# EAGLE design satshakit-grbl (EAGLE 8.4.3)

## Sheet 1 of 2
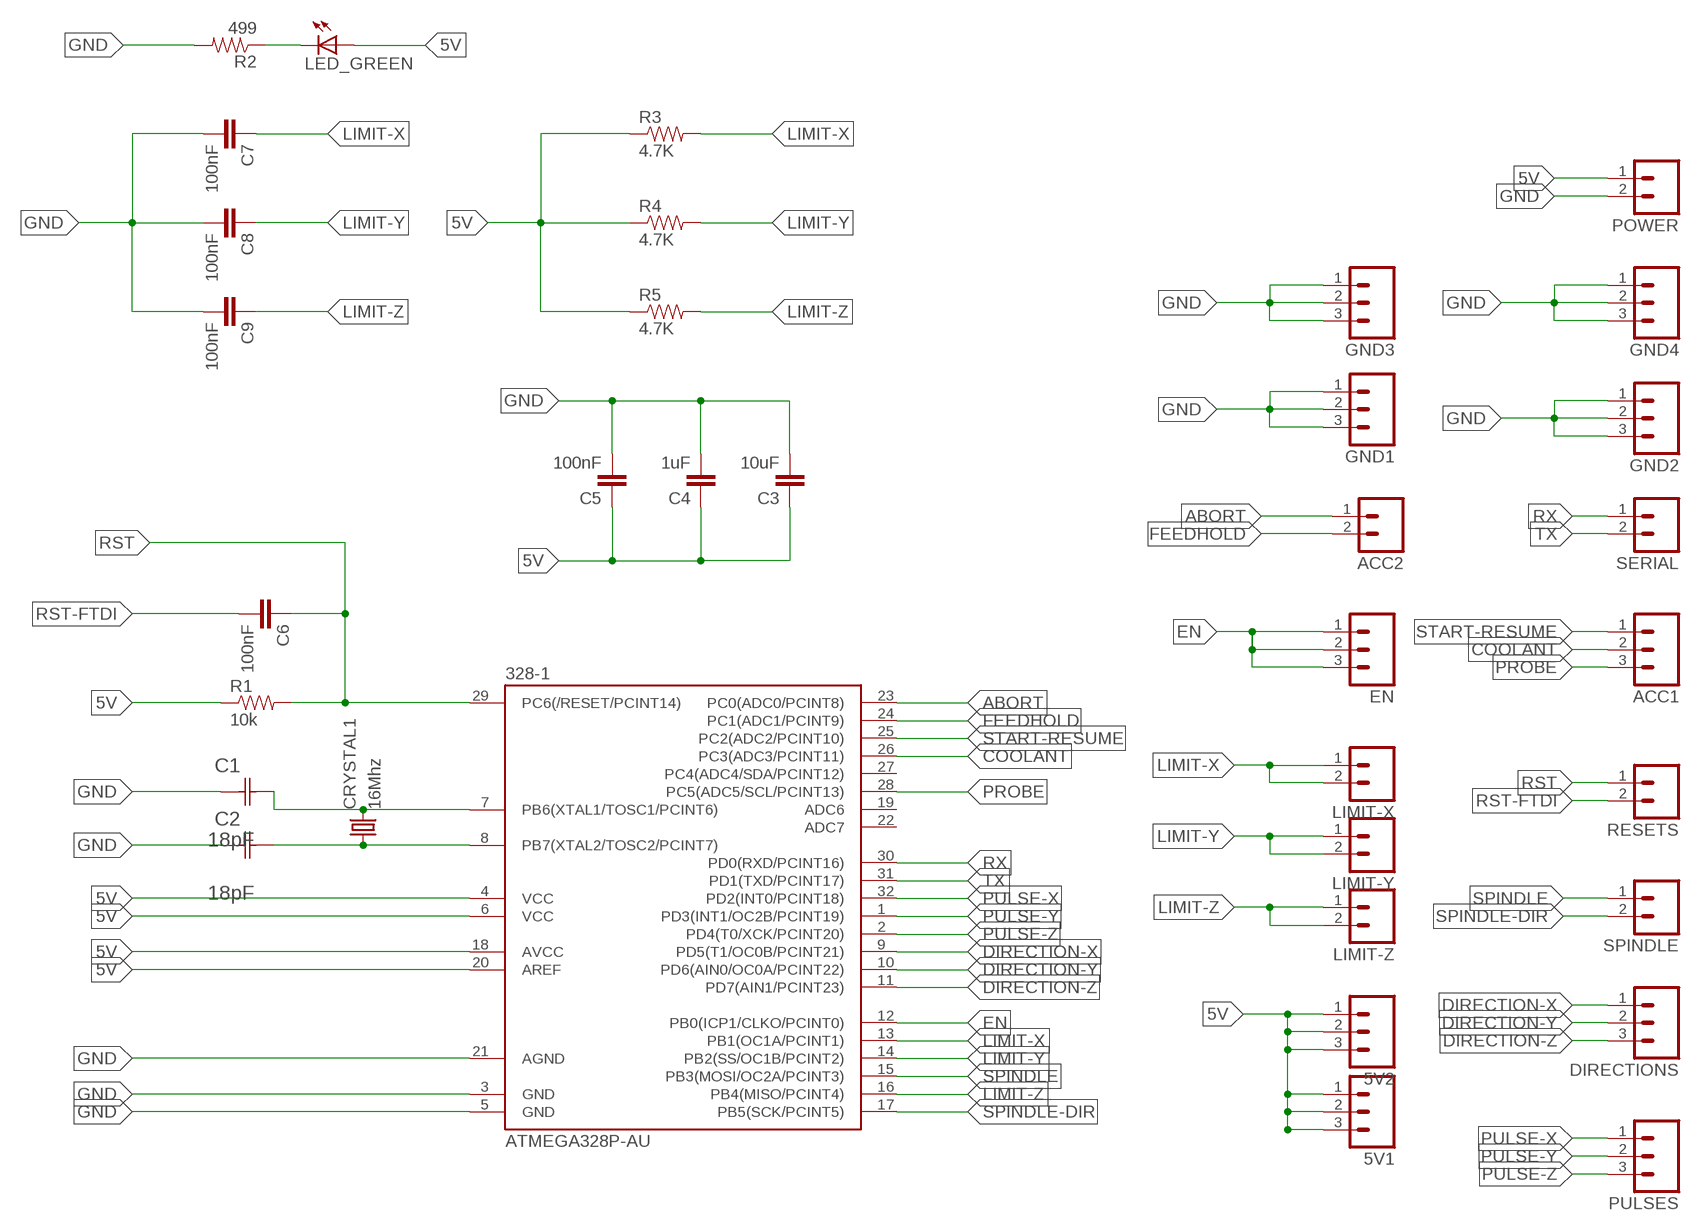
[diagram p0: schematic, sheet 1]

### Parts
5V1  M03  [03P]
5V2  M03  [03P]
328-1  ATMEGA328P-AU  ATMEGA48/88/168-AU  [TQFP32-08]
ACC1  M03  [03P]
ACC2  M02  [02P]
C1  18pF  0612ZC225MAT2A  [CAPC3216X178N]
C2  18pF  0612ZC225MAT2A  [CAPC3216X178N]
C3  10uF  CAP1206  [1206]
C4  1uF  CAP1206  [1206]
C5  100nF  CAP1206  [1206]
C6  100nF  CAP1206  [1206]
C7  100nF  CAP1206  [1206]
C8  100nF  CAP1206  [1206]
C9  100nF  CAP1206  [1206]
CRYSTAL1  16Mhz  CSM-7X-DU  [CSM-7X-DU]
DIRECTIONS  M03  [03P]
EN  M03  [03P]
GND1  M03  [03P]
GND2  M03  [03P]
GND3  M03  [03P]
GND4  M03  [03P]
LED_GREEN  LED1206  [1206]
LIMIT-X  M02  [02P]
LIMIT-Y  M02  [02P]
LIMIT-Z  M02  [02P]
POWER  M02  [02P]
PULSES  M03  [03P]
R1  10k  RESISTOR1206  [1206]
R2  499  RESISTOR1206  [1206]
R3  4.7K  RESISTOR1206  [1206]
R4  4.7K  RESISTOR1206  [1206]
R5  4.7K  RESISTOR1206  [1206]
RESETS  M02  [02P]
SERIAL  M02  [02P]
SPINDLE  M02  [02P]

### Nets
5V: 5V1.1 5V1.2 5V1.3 5V2.1 5V2.2 5V2.3 328-1.4(VCC) 328-1.6(VCC) 328-1.18(AVCC) 328-1.20(AREF) C3.1 C4.1 C5.1 LED_GREEN.1(A) POWER.1 R1.1 R3.1 R4.1 R5.1
ABORT: 328-1.23(PC0(ADC0/PCINT8)) ACC2.1
COOLANT: 328-1.26(PC3(ADC3/PCINT11)) ACC1.2
DIRECTION-X: 328-1.9(PD5(T1/OC0B/PCINT21)) DIRECTIONS.1
DIRECTION-Y: 328-1.10(PD6(AIN0/OC0A/PCINT22)) DIRECTIONS.2
DIRECTION-Z: 328-1.11(PD7(AIN1/PCINT23)) DIRECTIONS.3
EN: 328-1.12(PB0(ICP1/CLKO/PCINT0)) EN.1 EN.2 EN.3
FEEDHOLD: 328-1.24(PC1(ADC1/PCINT9)) ACC2.2
GND: 328-1.3(GND) 328-1.5(GND) 328-1.21(AGND) C1.1(C1) C2.1(C1) C3.2 C4.2 C5.2 C7.2 C8.2 C9.2 GND1.1 GND1.2 GND1.3 GND2.1 GND2.2 GND2.3 GND3.1 GND3.2 GND3.3 GND4.1 GND4.2 GND4.3 POWER.2 R2.2
LIMIT-X: 328-1.13(PB1(OC1A/PCINT1)) C7.1 LIMIT-X.1 LIMIT-X.2 R3.2
LIMIT-Y: 328-1.14(PB2(SS/OC1B/PCINT2)) C8.1 LIMIT-Y.1 LIMIT-Y.2 R4.2
LIMIT-Z: 328-1.16(PB4(MISO/PCINT4)) C9.1 LIMIT-Z.1 LIMIT-Z.2 R5.2
N$2: 328-1.7(PB6(XTAL1/TOSC1/PCINT6)) C1.2(C2) CRYSTAL1.2
N$9: 328-1.8(PB7(XTAL2/TOSC2/PCINT7)) C2.2(C2) CRYSTAL1.1
N$26: LED_GREEN.2(C) R2.1
PROBE: 328-1.28(PC5(ADC5/SCL/PCINT13)) ACC1.3
PULSE-X: 328-1.32(PD2(INT0/PCINT18)) PULSES.1
PULSE-Y: 328-1.1(PD3(INT1/OC2B/PCINT19)) PULSES.2
PULSE-Z: 328-1.2(PD4(T0/XCK/PCINT20)) PULSES.3
RST: 328-1.29(PC6(/RESET/PCINT14)) C6.1 R1.2 RESETS.1
RST-FTDI: C6.2 RESETS.2
RX: 328-1.30(PD0(RXD/PCINT16)) SERIAL.1
SPINDLE: 328-1.15(PB3(MOSI/OC2A/PCINT3)) SPINDLE.1
SPINDLE-DIR: 328-1.17(PB5(SCK/PCINT5)) SPINDLE.2
START-RESUME: 328-1.25(PC2(ADC2/PCINT10)) ACC1.1
TX: 328-1.31(PD1(TXD/PCINT17)) SERIAL.2
Unconnected: 328-1.19(ADC6) 328-1.22(ADC7) 328-1.27(PC4(ADC4/SDA/PCINT12))

## Sheet 2 of 2

## Library data of the parts
5V1 5V2 ACC1 DIRECTIONS EN GND1-GND4 PULSES = con-amp-quick:M03: AMP QUICK CONNECTOR; OC_FARNELL: unknown; OC_NEWARK: unknown
328-1 = atmega8:ATMEGA48/88/168
ACC2 LIMIT-X LIMIT-Y LIMIT-Z POWER RESETS SERIAL SPINDLE = con-amp-quick:M02: AMP QUICK CONNECTOR; OC_FARNELL: unknown; OC_NEWARK: unknown
C1 C2 = AVX_By_element14_Batch_1:0612ZC225MAT2A: Capacitor 1206; MPN: 0612ZC225MAT2A; OC_FARNELL: -; OC_NEWARK: 12N3209; SUPPLIER: AVX; TOLERANCE: ±20%; VALUE: 2.2µF; VOLTAGERATING: 10V
C3-C9 = 01_SparkFun:CAP: Capacitor Standard 0603 ceramic capacitor, and 0.1" leaded capacitor.
CRYSTAL1 = 01_FAB_Hello:CSM-7X-DU: SMD CRYSTAL Source: www.ecsxtal.com .. Crystal 3.6864MHz CSM_7X_DU.PDF; OC_FARNELL: unknown; OC_NEWARK: unknown
LED_GREEN = 01_FAB_Hello:LED
R1-R5 = 01_SparkFun:RESISTOR: Resistor Basic schematic elements and footprints for 0603, 1206, and PTH 1/10th watt (small) resistors.

## Board
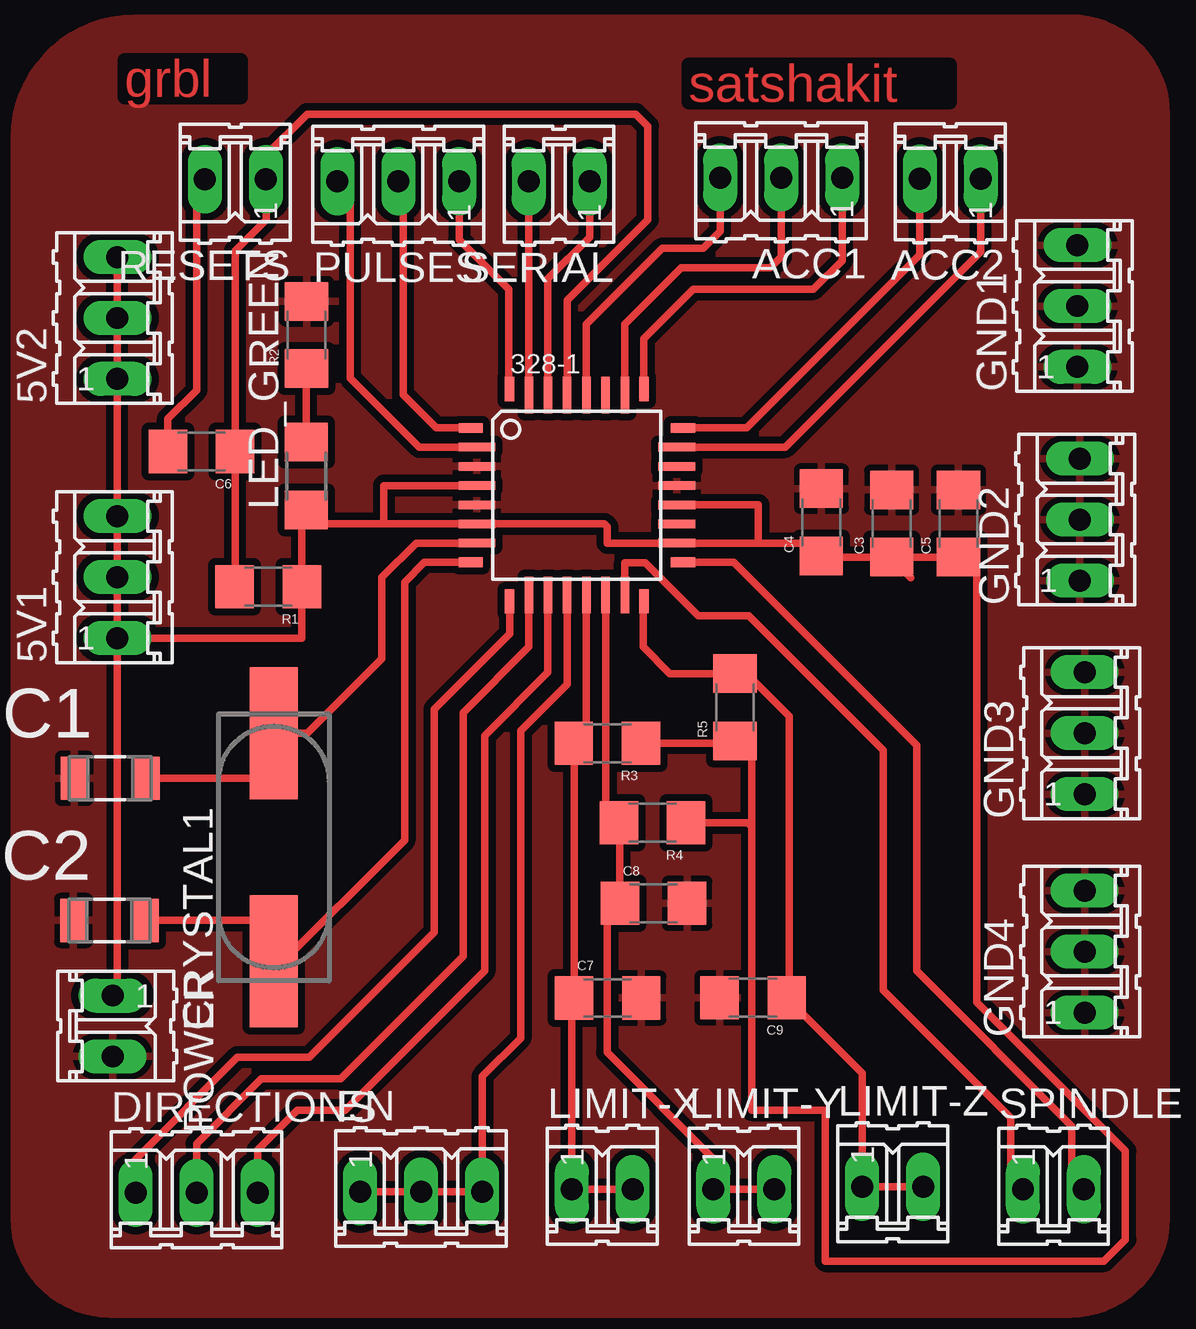
[diagram p1: board, top side]

No outline drawn. Coordinates in mm, seen from the top.
Copper layers (1*16): Top 0.035mm / dielectric 1.5mm / Bottom 0.035mm
Design rules "default": minimum track width 10mil, minimum drill 24mil, track to track 8mil, track to pad 8mil, pad to pad 8mil, via to via 8mil, smd to smd 8mil, copper to edge 40mil, drill to drill 8mil, minimum pad ring 10mil, minimum via ring 8mil, stop-mask expansion 4mil, vias tented up to drill 0mil, thermal gap 10mil

### Footprints (pad centres in the part's own frame; a part is rotated, then mirrored left to right if it is on the bottom)
03P = drill 0.914 long: 1 -2.54,0; 2 0,0; 3 2.54,0
TQFP32-08 = smd 1.016 x 0.406: 1 -4.42,2.8; 8 -4.42,-2.8; 17 4.42,-2.8; 24 4.42,2.8 | smd 1.524 x 0.356: 2 -4.166,2; 3 -4.166,1.2; 4 -4.166,0.4; 5 -4.166,-0.4; 6 -4.166,-1.2; 7 -4.166,-2; 18 4.166,-2; 19 4.166,-1.2; 20 4.166,-0.4; 21 4.166,0.4; 22 4.166,1.2; 23 4.166,2 | smd 0.406 x 1.016: 9 -2.8,-4.42; 16 2.8,-4.42; 25 2.8,4.42; 32 -2.8,4.42 | smd 0.356 x 1.524: 10 -2,-4.166; 11 -1.2,-4.166; 12 -0.4,-4.166; 13 0.4,-4.166; 14 1.2,-4.166; 15 2,-4.166; 26 2,4.166; 27 1.2,4.166; 28 0.4,4.166; 29 -0.4,4.166; 30 -1.2,4.166; 31 -2,4.166
02P = drill 0.914 long: 1 -1.27,0; 2 1.27,0
CAPC3216X178N = smd 1.118 x 1.803: 1 -1.499,0; 2 1.499,0
1206 = smd 1.6 x 1.8: 1 -1.4,0; 2 1.4,0
CSM-7X-DU = smd 5.5 x 2: 1 -4.75,0; 2 4.75,0
1206' = smd 1.6 x 1.803: 1 -1.422,0; 2 1.422,0

### Placement (x,y rotation side)
5V1  56.3,51.7 90 top
5V2  56.3,62.5 90 top
328-1  75.44,55.12 0 top
ACC1  83.95,68.35 180 top
ACC2  91,68.3 180 top
C1  56,43.32 0 top
C2  55.96,37.4 0 top
C3  88.56,53.94 90 top
C4  85.63,53.99 90 top
C5  91.34,53.94 90 top
C6  59.8,56.94 180 top
C7  76.72,34.17 0 top
C8  78.63,38.11 0 top
C9  82.79,34.18 180 top
CRYSTAL1  62.82,40.45 90 top
DIRECTIONS  59.6,26.05 0 top
EN  68.95,26.1 0 top
GND1  96.3,63 90 top
GND2  96.4,54.1 90 top
GND3  96.6,45.2 90 top
GND4  96.6,36.1 90 top
LED_GREEN  [1206']  64.16,55.92 90 top
LIMIT-X  76.5,26.2 0 top
LIMIT-Y  82.4,26.2 0 top
LIMIT-Z  88.6,26.3 0 top
POWER  56.1,33 270 top
PULSES  68,68.2 180 top
R1  62.58,51.3 180 top
R2  64.18,61.79 90 top
R3  76.71,44.78 180 top
R4  78.59,41.47 180 top
R5  82.03,46.28 90 top
RESETS  61.21,68.28 180 top
SERIAL  74.7,68.2 180 top
SPINDLE  95.3,26.2 0 top

### Tracks (layer width: path | path; a pad name or v marks a point on that pad's centre or on a via)
5V
  Top 0.254: 328-1.20 78.99,54.72 78.99,54.74
  Top 0.305: 328-1.18 | 328-1.20 | 79.6,53.09 328-1.18 | 328-1.20 78.99,54.74 | 71.96,53.92 328-1.6 | 328-1.18 76.71,53.12 76.71,53.8 76.59,53.92 328-1.6 | R3.1 81.83,44.78 R5.1 82.73,44.18 82.73,41.3 | R4.1 82.56,41.47 82.73,41.3 | 82.73,41.3 82.73,29.5 85.8,29.5 85.8,23.2 97.4,23.2 98.3,24.1 98.3,27.8 92.1,34 92.1,51.78 C5.1 C3.1 | 67.4,53.92 328-1.6 | 67.4,53.92 64.16,53.92 LED_GREEN.1 63.98,54.5 R1.1 63.98,49.16 5V1.1 | 87.81,52.59 C3.1 | 88.21,52.19 C3.1 | 328-1.4 67.4,55.52 67.4,53.92 | 88.47,52.56 88.31,52.59 | 88.47,52.56 C3.1 | 89.35,51.68 88.47,52.56 | C3.1 85.68,52.54 C4.1 85.1,53.12 83,53.12 | 83,53.12 328-1.18 | 5V1.1 5V1.2 5V1.3 5V2.1 5V2.2 5V2.3 | 328-1.20 83,54.72 83,53.12 | 5V1.1 56,49.16 | 5V1.1 56.3,34.47 POWER.1
ABORT
  Top 0.305: 328-1.23 84.12,57.12 92.27,65.27 ACC2.1
COOLANT
  Top 0.305: 328-1.26 77.44,62.24 79.8,64.6 83.5,64.6 83.95,65.05 ACC1.2
DIRECTION-X
  Top 0.305: 328-1.9 72.64,49.34 69.5,46.2 69.5,36.9 64.3,31.7 61.3,31.7 57.06,27.46 DIRECTIONS.1
DIRECTION-Y
  Top 0.305: 328-1.10 73.44,48.8 70.7,46.06 70.7,35.9 65.6,30.8 62.3,30.8 59.6,28.1 DIRECTIONS.2
DIRECTION-Z
  Top 0.305: 328-1.11 74.24,47.74 71.6,45.1 71.6,35.3 65.8,29.5 63.8,29.5 62.14,27.84 DIRECTIONS.3
EN
  Top 0.305: 75.06,50.95 328-1.12 75.04,47.24 73.1,45.3 73.1,32.5 71.5,30.9 71.5,26.2 71.4,26.1 | EN.1 EN.2 71.4,26.1 | 71.4,26.1 EN.3
FEEDHOLD
  Top 0.305: 328-1.24 82.52,57.92 89.73,65.13 ACC2.2
GND
  Top 0.305: 328-1.5 | 328-1.21
  pour Top (isolate 0.305): 52,25 52,70 arc-90 57,75 96,75 arc-90 100,71 100,25 arc-90 96,21 56,21 arc-90
LIMIT-X
  Top 0.305: 328-1.13 75.84,44.78 R3.2 75.32,44.77 75.32,34.3 | 75.32,34.2 75.32,34.3 | 75.32,34.2 C7.1 | 75.93,33.69 75.32,34.3 | 75.53,33.99 75.32,34.2 | LIMIT-X.2 LIMIT-X.1 75.23,34.11 75.32,34.2
LIMIT-Y
  Top 0.305: C8.1 77.23,41.43 R4.2 76.64,42.02 328-1.14 | 76.9,37.78 C8.1 | C8.1 76.7,37.58 76.7,31.9 81.13,27.47 LIMIT-Y.1 LIMIT-Y.2
LIMIT-Z
  Top 0.305: 328-1.16 78.2,50.66 78.2,48.8 79.32,47.68 R5.2 82.52,47.68 84.3,45.9 84.3,34.29 C9.1 87.33,31.03 LIMIT-Z.1 LIMIT-Z.2
N$2
  Top 0.305: 71.27,53.09 328-1.7 68.74,53.12 67.31,51.69 67.31,48.31 64.2,45.2 CRYSTAL1.2 | 62.82,43.32 CRYSTAL1.2 | C1.2 62.82,43.32 | 62.82,43.32 CRYSTAL1.2
N$9
  Top 0.305: 328-1.8 69.08,52.32 68.26,51.5 68.26,40.74 62.82,35.3 CRYSTAL1.1 | 62.82,37.4 CRYSTAL1.1 | C2.2 62.82,37.4 | 62.82,37.4 CRYSTAL1.1
N$26
  Top 0.305: LED_GREEN.2 64.16,60.39 R2.1
PROBE
  Top 0.305: 328-1.28 75.84,62.24 79,65.4 80.7,65.4 81.41,66.11 ACC1.3
PULSE-X
  Top 0.305: PULSES.1 70.54,65.76 72.6,63.7 72.6,59.58 328-1.32
PULSE-Y
  Top 0.305: 328-1.1 69.58,57.92 68.2,59.3 68.2,68 PULSES.2
PULSE-Z
  Top 0.305: 328-1.2 68.88,57.12 66,60 66,67.5 65.46,68.04 PULSES.3
RST
  Top 0.305: R1.2 61.2,51.32 C6.1 61.2,65.3 62.5,66.6 62.5,68.26 RESETS.1 62.48,69.28 64.2,71 77.9,71 78.4,70.5 78.4,66.6 75.04,63.24 328-1.29
RST-FTDI
  Top 0.305: C6.2 58.4,58.3 59.6,59.5 59.6,67.94 RESETS.2
RX
  Top 0.305: 328-1.30 74.24,64.14 75.97,65.87 SERIAL.1
SPINDLE
  Top 0.305: 328-1.15 77.44,52.3 78.3,52.3 80.5,50.1 82.6,50.1 88.2,44.5 88.2,34.5 93.53,29.17 93.53,26.7 SPINDLE.1
SPINDLE-DIR
  Top 0.305: 328-1.17 81.98,52.32 89.6,44.7 89.6,35.3 96.07,28.83 96.07,26.7 SPINDLE.2
START-RESUME
  Top 0.305: 328-1.25 78.24,61.64 80.3,63.7 85.3,63.7 86.49,64.89 ACC1.1
TX
  Top 0.305: SERIAL.2 328-1.31

### Text on the board
Top: grbl | satshakit